# Altium project S3_LCD_GC9503.PrjPcb
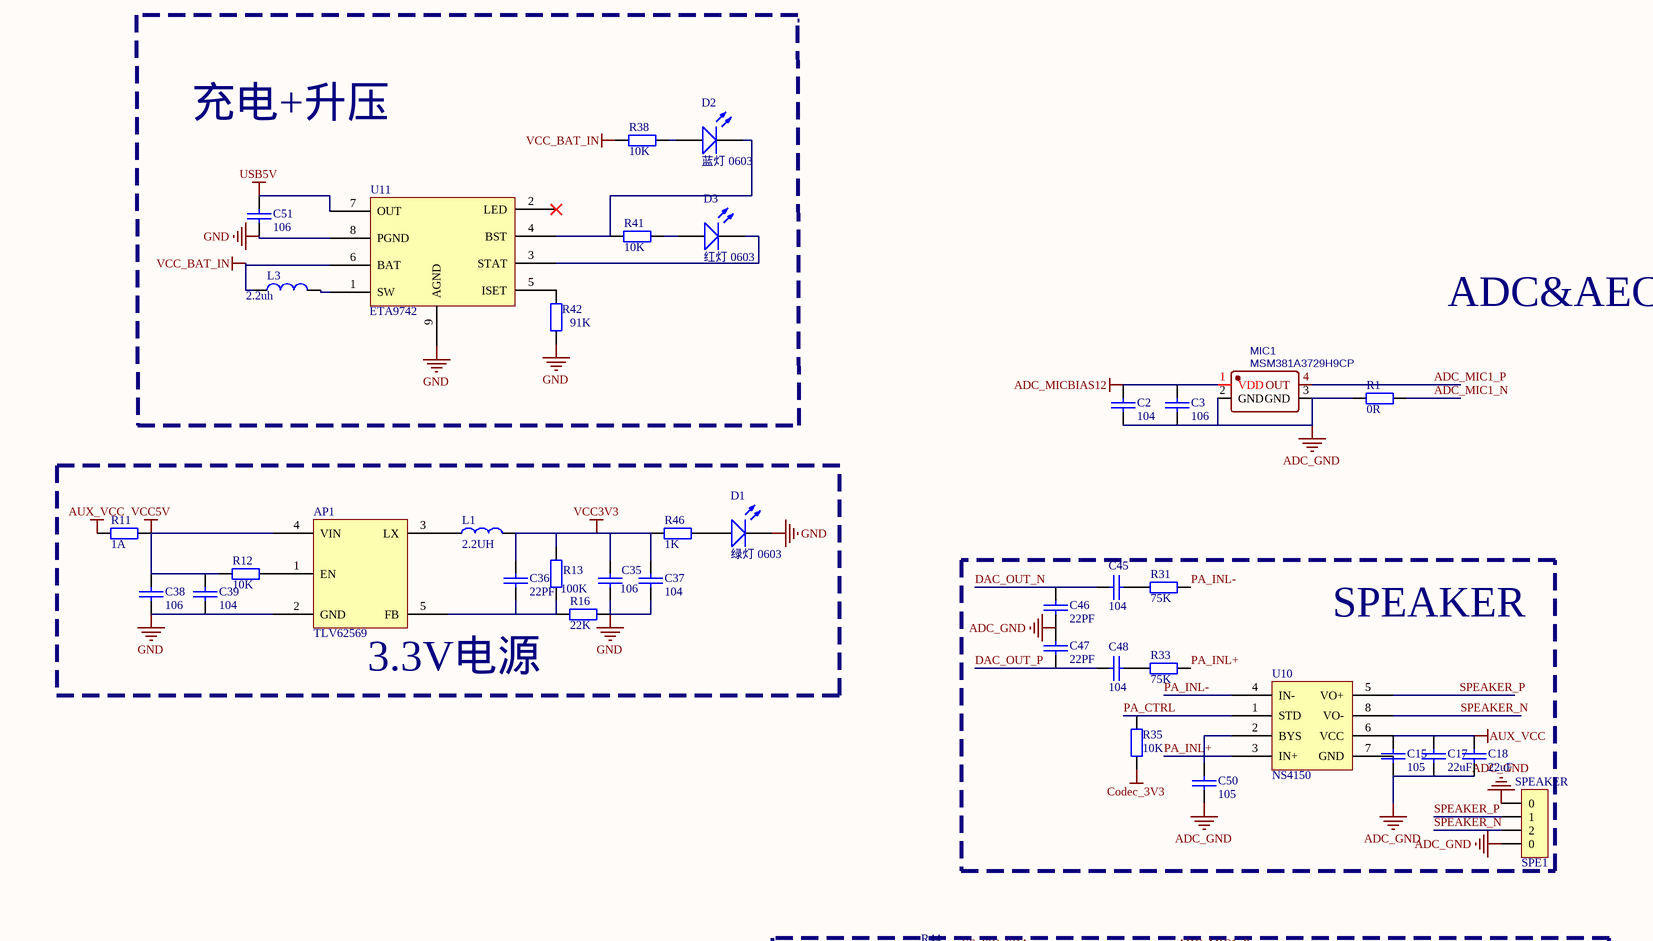
[diagram p0: S3_LCD_GC9503_.SchDoc, top left]
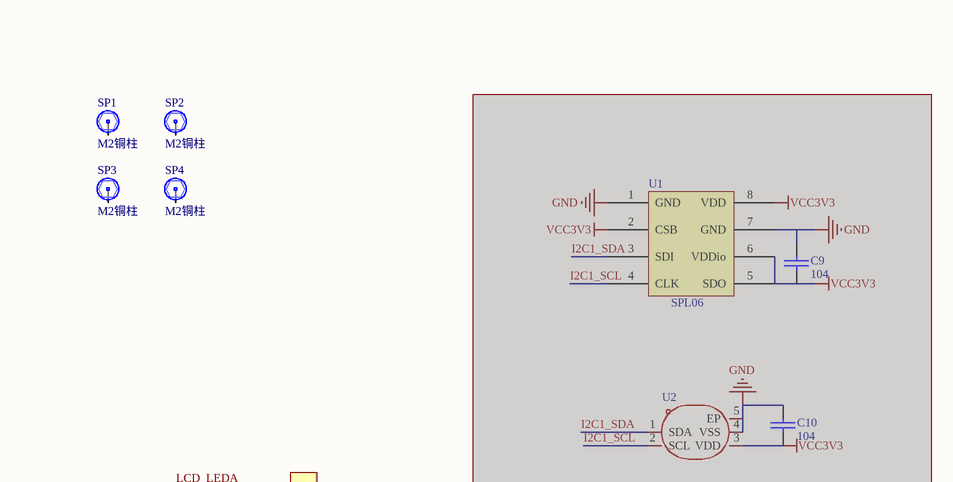
[diagram p1: S3_LCD_GC9503_.SchDoc, top right]
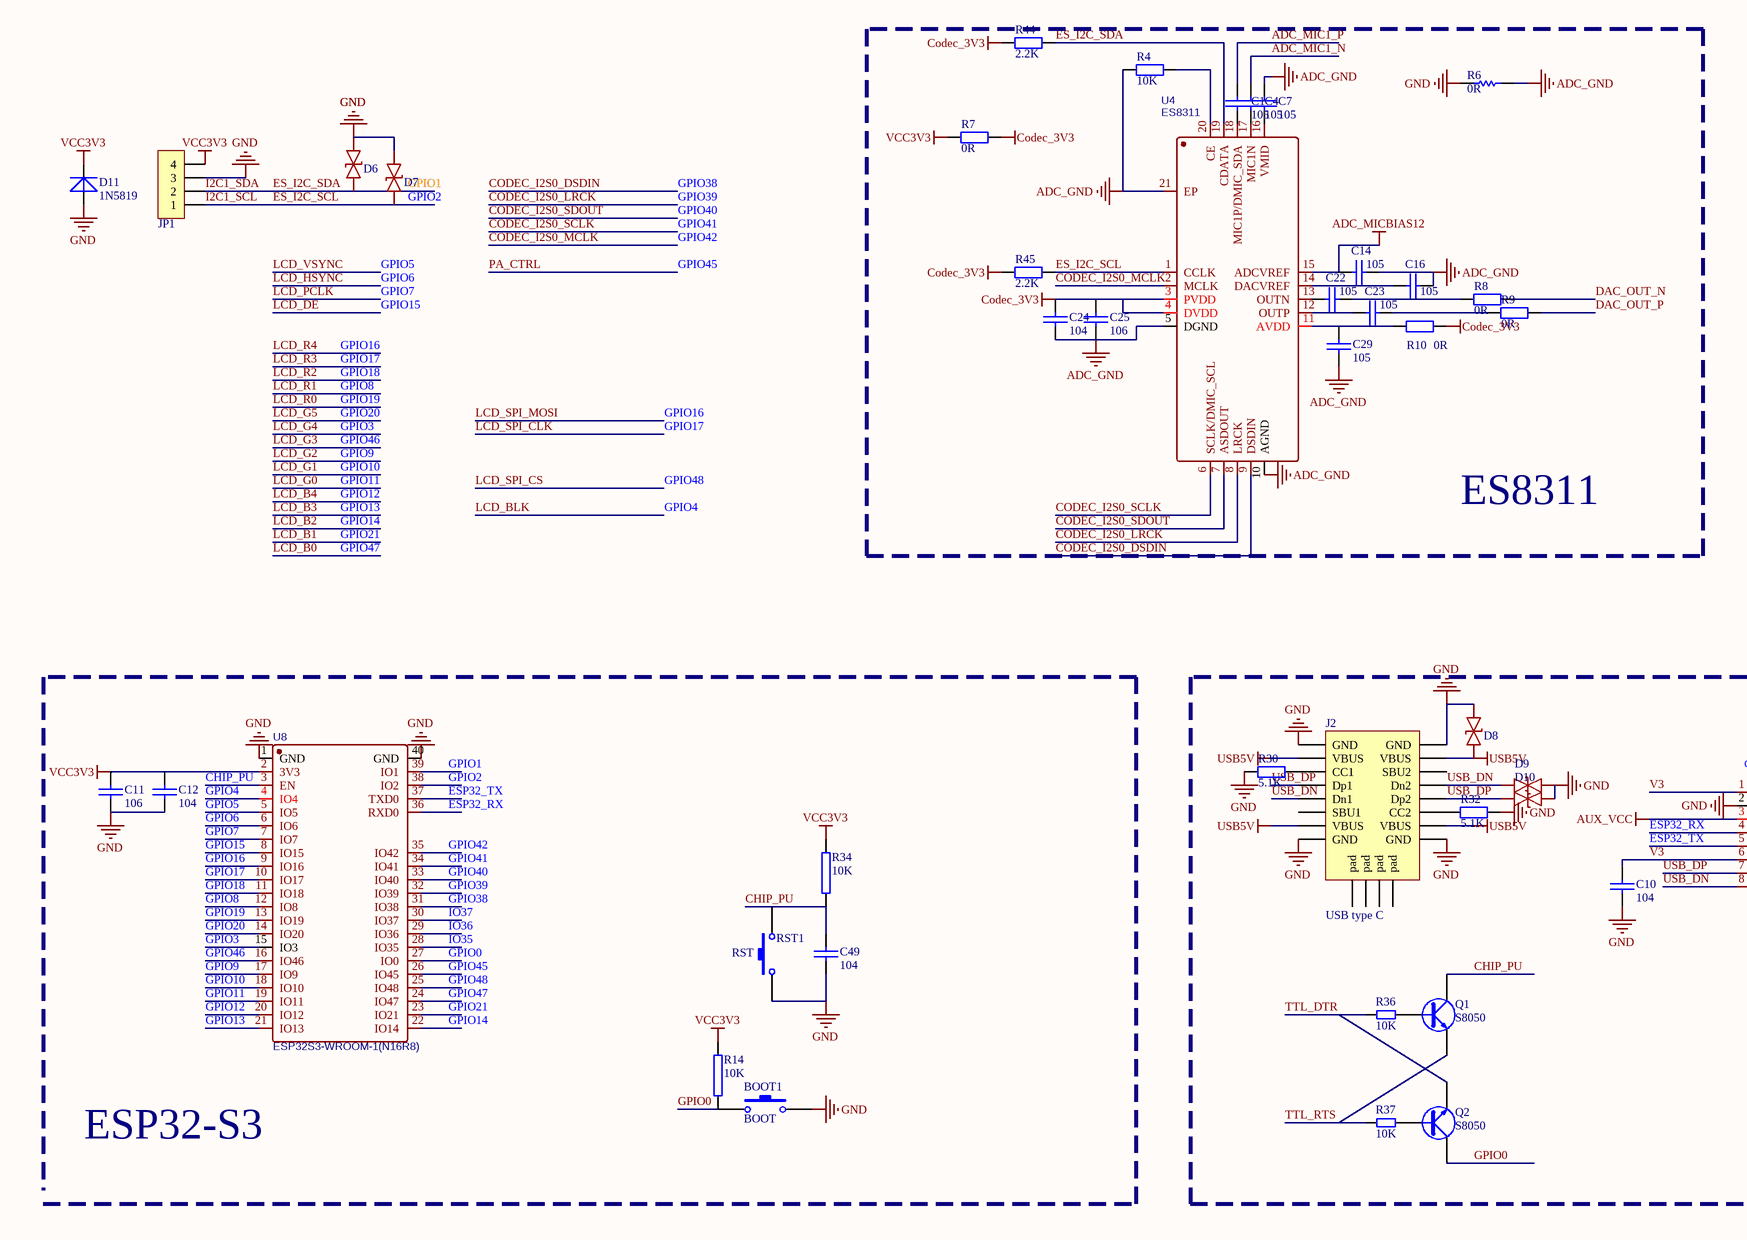
[diagram p2: S3_LCD_GC9503_.SchDoc, bottom left]
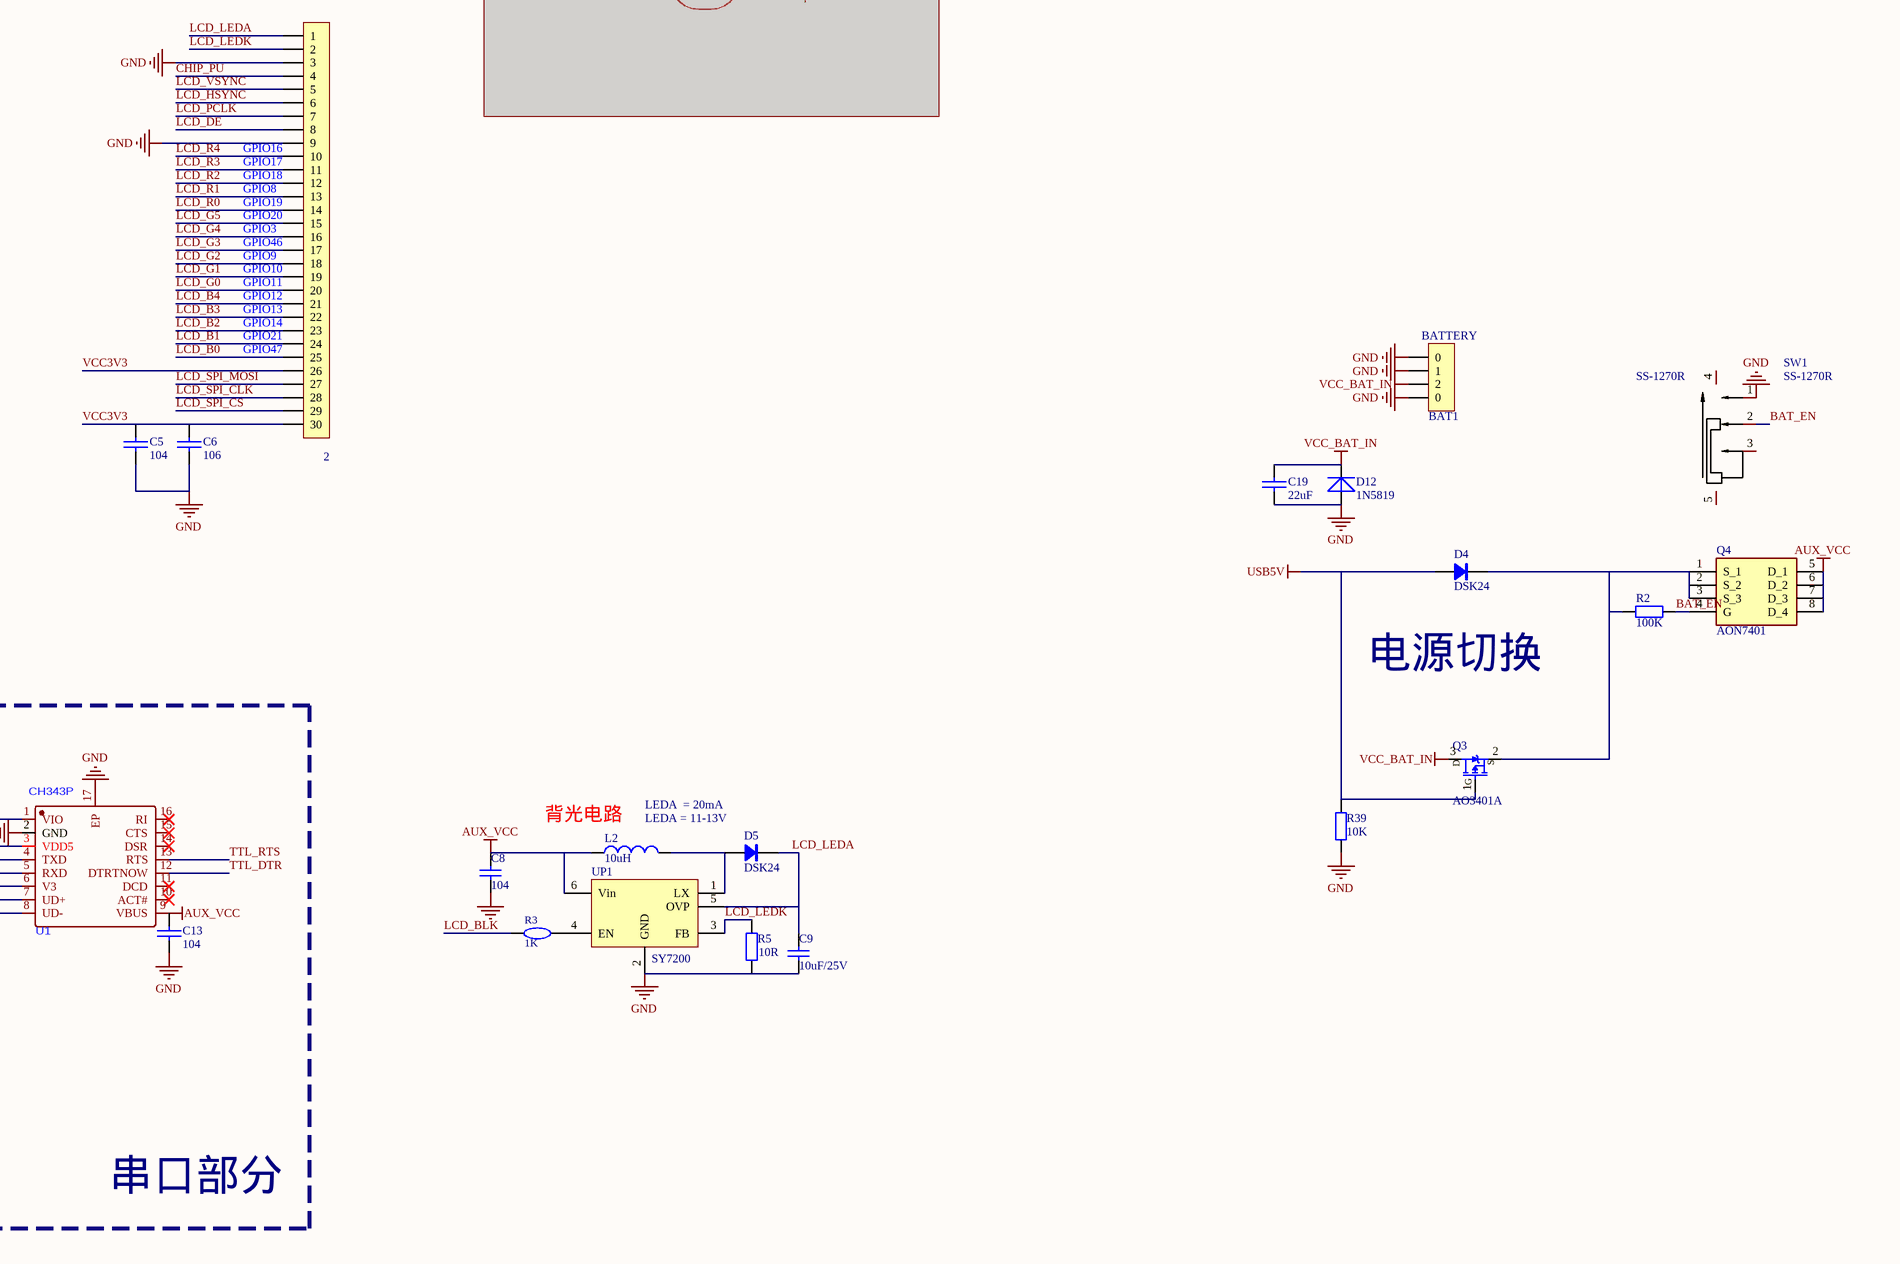
[diagram p3: S3_LCD_GC9503_.SchDoc, bottom right]
1 sheet, 109 parts. Net scope: global (net labels, ports and power ports of the same name join across sheets).
Board file: S3_LCD_GC9503_.PcbDoc

## Sheet S3_LCD_GC9503_.SchDoc
size A1; SheetNumber: 1; SheetTotal: 1

### Parts
(Parts that share a designator on the sheet are numbered #1, #2 ... from top to bottom, then left to right.)
2  FPC0.5-30P  [FPC0.5 2H-WS-30P]  (value not drawn)
AP1  TLV62569  [SOT23-5N]
BAT1  BATTERY  [MOLEX 53398-0271]
BOOT1  BOOT  [TSW 3*6*4.3-S-W]
C1  105  [CAP_0402]
C2  104  [CAP_0402]
C3  106  [C0603]
C4  105  [CAP_0402]
C5  104  [CAP_0402]
C6  106  [CAP_0402]
C7  105  [CAP_0402]
C8  104  [CAP_0402]
C9#1  104  [LC-0402_C]  (masked out: inside a compile mask, not in the netlist)
C9#2  10uF/25V  [C 1206_M]
C10#1  104  [LC-0402_C]  (masked out: inside a compile mask, not in the netlist)
C10#2  104  [CAP_0402]
C11  106  [C0603]
C12  104  [CAP_0402]
C13  104  [CAP_0402]
C14  105  [CAP_0402]
C15  105  [CAP_0402]
C16  105  [CAP_0402]
C17  22uF  [C0603]
C18  22uF  [C0603]
C19  22uF  [C0603]
C22  105  [CAP_0402]
C23  105  [CAP_0402]
C24  104  [CAP_0402]
C25  106  [CAP_0402]
C29  105  [CAP_0402]
C35  106  [C0603]
C36  22PF  [CAP_0402]
C37  104  [CAP_0402]
C38  106  [C0603]
C39  104  [CAP_0402]
C45  104  [CAP_0402]
C46  22PF  [CAP_0402]
C47  22PF  [CAP_0402]
C48  104  [CAP_0402]
C49  104  [CAP_0402]
C50  105  [CAP_0402]
C51  106  [C0603]
D1  绿灯 0603  [0603_LED_S1]
D2  蓝灯 0603  [0603_LED_S1]
D3  红灯 0603  [0603_LED_S1]
D4  DSK24  [SOD-123]
D5  DSK24  [SOD-123]
D6  LESD5D5.0CT1G  [SOD-523]  (value not drawn)
D7  LESD5D5.0CT1G  [SOD-523]  (value not drawn)
D8  LESD5D5.0CT1G  [SOD-523]  (value not drawn)
D9  LESD5D5.0CT1G  [SOD-523]  (value not drawn)
D10  LESD5D5.0CT1G  [SOD-523]  (value not drawn)
D11  1N5819  [SOD-323]
D12  1N5819  [SOD-323]
J2  USB type C  [USB Type-C-16Pin_A]
JP1  HDR-1X4  [MX 1.25-WS-4P]  (value not drawn)
L1  2.2UH  [NR2520]
L2  10uH  [CD42]
L3  2.2uh  [NR2520]
MIC1  MSM381A3729H9CP  [MIC-SMD_4P-L3.8-W3.0-P2.46-S1.70-TR]
Q1  S8050  [SOT23-3N]
Q2  S8050  [SOT23-3N]
Q3  AO3401A  [SOT23-3N]
Q4  AON7401  [DFN_3X3_EP]
R1  0R  [RES_0402]
R2  100K  [RES_0402]
R3  1K  [RES_0402]
R4  10K  [RES_0402]
R5  10R  [R 0805_L]
R6  0R  [R 0603_L]
R7  0R  [RES_0402]
R8  0R  [RES_0402]
R9  0R  [RES_0402]
R10  0R  [RES_0402]
R11  1A  [0805_R]
R12  10K  [RES_0402]
R13  100K  [RES_0402]
R14  10K  [RES_0402]
R16  22K  [RES_0402]
R30  5.1K  [RES_0402]
R31  75K  [RES_0402]
R32  5.1K  [RES_0402]
R33  75K  [RES_0402]
R34  10K  [RES_0402]
R35  10K  [RES_0402]
R36  10K  [RES_0402]
R37  10K  [RES_0402]
R38  10K  [RES_0402]
R39  10K  [RES_0402]
R41  10K  [RES_0402]
R42  91K  [LC-0603_R]
R44  2.2K  [RES_0402]
R45  2.2K  [RES_0402]
R46  1K  [RES_0402]
RST1  RST  [TSW 3*6*4.3-S-W]
SP1  M2铜柱  [M2_1MM_3.5_6.5]
SP2  M2铜柱  [M2_1MM_3.5_6.5]
SP3  M2铜柱  [M2_1MM_3.5_6.5]
SP4  M2铜柱  [M2_1MM_3.5_6.5]
SPE1  SPEAKER  [MOLEX 53398-0271]
SW1  SS-1270R  [SW-TH_MSK01-AG1.5]
U1#1  SPL06  [BMP280]  (masked out: inside a compile mask, not in the netlist)
U1#2  CH343P  [QFN16_3*3_PAD]
U2  SHT40-AD1B with pin  [SENSORM-SMD_SHT40-AD1B]  (value not drawn)  (masked out: inside a compile mask, not in the netlist)
U4  ES8311  [ES8311]
U8  ESP32S3-WROOM-1(N16R8)  [ESP32S3-WROOM-1]
U10  NS4150  [MSOP-8]
U11  ETA9742  [SOIC-8(add 9pin)]
UP1  SY7200  [SOT23-6]

### Blocks framed on the sheet
3.3V电源: AP1 C35-C39 D1 L1 R11-R13 R16 R46
SPEAKER: C15 C17 C18 C45-C48 C50 R31 R33 R35 SPE1 U10
ES8311: C1 C4 C7 C14 C16 C22-C25 C29 R4 R6-R10 R44 R45 U4
串口部分: C10#2 C13 D8-D10 J2 Q1 Q2 R30 R32 R36 R37 U1#2

### Nets
ADC_GND: C2.2 C3.2 C7.2 C14.1 C15.2 C16.2 C17.2 C18.2 C24.2 C25.2 C29.2 C46.2 C47.1 C50.2 MIC1.2(GND) MIC1.3(GND) R1.2 R4.2 R6.2 SPE1.0 U4.5(DGND) U4.10(AGND) U4.21(EP) U10.7(GND)
ADC_MICBIAS12: C2.1 C3.1 C14.2 MIC1.1(VDD) U4.15(ADCVREF)
AUX_VCC: C8.2 C13.2 C15.1 C17.1 C18.1 L2.1 Q4.5(D_1) Q4.6(D_2) Q4.7(D_3) Q4.8(D_4) R11.2 U1#2.3(VDD5) U1#2.9(VBUS) U10.6(VCC) UP1.6(Vin)
Codec_3V3: C24.1 C25.1 R7.1 R10.1 R35.2 R44.2 R45.2 U4.3(PVDD) U4.4(DVDD)
GND: 2.3 2.9 AP1.2(GND) BAT1.0 BAT1.1 BOOT1.2 C5.2 C6.2 C8.1 C9#2.1 C10#2.2 C11.1 C12.1 C13.1 C19.2 C35.1 C37.1 C38.1 C39.1 C49.1 C51.2 D1.K D6.2 D7.2 D8.2 D9.2 D10.2 D11.1 D12.1 J2.A1(GND) J2.A12(GND) J2.B1(GND) J2.B12(GND) JP1.3 R5.2 R6.1 R16.1 R30.1 R32.2 R39.1 R42.2 RST1.1 SW1.1 U1#2.2(GND) U1#2.17(EP) U8.1(GND) U8.40(GND) U11.8(PGND) U11.9(AGND) UP1.2(GND)
USB5V: C51.1 D4.1(A) D8.1 J2.A4(VBUS) J2.A9(VBUS) J2.B4(VBUS) J2.B9(VBUS) Q3.1(G) R39.2 U11.7(OUT)
VCC3V3: 2.26 2.30 C5.1 C6.1 C11.2 C12.2 C35.2 C36.2 C37.2 D11.2 JP1.4 L1.1 R7.2 R13.1 R14.1 R34.1 R46.2 U8.2(3V3)
VCC5V: AP1.4(VIN) C38.2 C39.2 R11.1 R12.2
VCC_BAT_IN: BAT1.2 C19.1 D12.2 L3.1 Q3.3(D) R38.2 U11.6(BAT)
ADC_MIC1_N: C4.2 R1.1
ADC_MIC1_P: C1.2 MIC1.4(OUT)
BAT_EN: Q4.4(G) R2.1 SW1.2
CHIP_PU: 2.4 C49.2 Q1.3(C) R34.2 RST1.2 U8.3(EN)
CODEC_I2S0_DSDIN: U4.9(DSDIN) U8.31(IO38)  [also labelled GPIO38]
CODEC_I2S0_LRCK: U4.8(LRCK) U8.32(IO39)  [also labelled GPIO39]
CODEC_I2S0_MCLK: U4.2(MCLK) U8.35(IO42)  [also labelled GPIO42]
CODEC_I2S0_SCLK: U4.6(SCLK/DMIC_SCL) U8.34(IO41)  [also labelled GPIO41]
CODEC_I2S0_SDOUT: U4.7(ASDOUT) U8.33(IO40)  [also labelled GPIO40]
DAC_OUT_N: C45.2 C46.1 R8.1
DAC_OUT_P: C47.2 C48.2 R9.1
ES_I2C_SCL: D7.1 JP1.1 R45.1 U4.1(CCLK) U8.38(IO2)  [also labelled GPIO2, I2C1_SCL]
ES_I2C_SDA: D6.1 JP1.2 R44.1 U4.19(CDATA) U8.39(IO1)  [also labelled GPIO1, I2C1_SDA]
ESP32_RX: U1#2.4(TXD) U8.36(RXD0)
ESP32_TX: U1#2.5(RXD) U8.37(TXD0)
GPIO0: BOOT1.1 Q2.3(C) R14.2 U8.27(IO0)
GPIO3: 2.16 U8.15(IO3)  [also labelled LCD_G4]
GPIO4: R3.1 U8.4(IO4)  [also labelled LCD_BLK]
GPIO5: 2.5 U8.5(IO5)  [also labelled LCD_VSYNC]
GPIO6: 2.6 U8.6(IO6)  [also labelled LCD_HSYNC]
GPIO7: 2.7 U8.7(IO7)  [also labelled LCD_PCLK]
GPIO8: 2.13 U8.12(IO8)  [also labelled LCD_R1]
GPIO9: 2.18 U8.17(IO9)  [also labelled LCD_G2]
GPIO10: 2.19 U8.18(IO10)  [also labelled LCD_G1]
GPIO11: 2.20 U8.19(IO11)  [also labelled LCD_G0]
GPIO12: 2.21 U8.20(IO12)  [also labelled LCD_B4]
GPIO13: 2.22 U8.21(IO13)  [also labelled LCD_B3]
GPIO14: 2.23 U8.22(IO14)  [also labelled LCD_B2]
GPIO15: 2.8 U8.8(IO15)  [also labelled LCD_DE]
GPIO16: 2.10 2.27 U8.9(IO16)  [also labelled LCD_R4, LCD_SPI_MOSI]
GPIO17: 2.11 2.28 U8.10(IO17)  [also labelled LCD_R3, LCD_SPI_CLK]
GPIO18: 2.12 U8.11(IO18)  [also labelled LCD_R2]
GPIO19: 2.14 U8.13(IO19)  [also labelled LCD_R0]
GPIO20: 2.15 U8.14(IO20)  [also labelled LCD_G5]
GPIO21: 2.24 U8.23(IO21)  [also labelled LCD_B1]
GPIO45: R35.1 U8.26(IO45) U10.1(STD)  [also labelled PA_CTRL]
GPIO46: 2.17 U8.16(IO46)  [also labelled LCD_G3]
GPIO47: 2.25 U8.24(IO47)  [also labelled LCD_B0]
GPIO48: 2.29 U8.25(IO48)  [also labelled LCD_SPI_CS]
IO35: U8.28(IO35)
IO36: U8.29(IO36)
IO37: U8.30(IO37)
LCD_LEDA: 2.1 C9#2.2 D5.2(K) UP1.5(OVP)
LCD_LEDK: 2.2 R5.1 UP1.3(FB)
PA_INL+: R33.2 U10.3(IN+)
PA_INL-: R31.2 U10.4(IN-)
SPEAKER_N: SPE1.2 U10.8(VO-)
SPEAKER_P: SPE1.1 U10.5(VO+)
TTL_DTR: Q2.2(E) R36.1 U1#2.12(DTRTNOW)
TTL_RTS: Q1.2(E) R37.1 U1#2.13(RTS)
USB_DN: D9.1 J2.A7(Dn1) J2.B7(Dn2) U1#2.8(UD-)
USB_DP: D10.1 J2.A6(Dp1) J2.B6(Dp2) U1#2.7(UD+)
V3: C10#2.1 U1#2.1(VIO) U1#2.6(V3)
NetAP1_1: AP1.1(EN) R12.1
NetAP1_3: AP1.3(LX) L1.2
NetAP1_5: AP1.5(FB) C36.1 R13.2 R16.2
NetC1_1: C1.1 U4.18(MIC1P/DMIC_SDA)
NetC4_1: C4.1 U4.17(MIC1N)
NetC7_1: C7.1 U4.16(VMID)
NetC16_1: C16.1 U4.14(DACVREF)
NetC22_1: C22.1 R8.2
NetC22_2: C22.2 U4.13(OUTN)
NetC23_1: C23.1 R9.2
NetC23_2: C23.2 U4.12(OUTP)
NetC29_1: C29.1 R10.2 U4.11(AVDD)
NetC45_1: C45.1 R31.1
NetC48_1: C48.1 R33.1
NetC50_1: C50.1 U10.2(BYS)
NetD1_A: D1.A R46.1
NetD2_A: D2.A R38.1
NetD2_K: D2.K R41.2 U11.4(BST)
NetD3_A: D3.A R41.1
NetD3_K: D3.K U11.3(STAT)
NetD4_2: D4.2(K) Q3.2(S) Q4.1(S_1) Q4.2(S_2) Q4.3(S_3) R2.2
NetD5_1: D5.1(A) L2.2 UP1.1(LX)
NetJ2_A5: J2.A5(CC1) R30.2
NetJ2_B5: J2.B5(CC2) R32.1
NetL3_2: L3.2 U11.1(SW)
NetQ1_1: Q1.1(B) R36.2
NetQ2_1: Q2.1(B) R37.2
NetR3_2: R3.2 UP1.4(EN)
NetR4_1: R4.1 U4.20(CE)
NetR42_1: R42.1 U11.5(ISET)

Not connected (* = marked no-connect by the designer): J2 0(pad) A8(SBU1) B8(SBU2); SP1 1; SP2 1; SP3 1; SP4 1; SW1 3 4 5; U1#2 10(ACT#)* 11(DCD)* 14(DSR)* 15(CTS)* 16(RI)*; U11 2(LED)*

### Notes on the sheet
- 充电+升压
- ADC&AEC
- 电源切换
- (near L2) 背光电路
- LEDA  = 20mA
- LEDA = 11-13V
- ESP32-S3

### Library data of the parts
2 = FPC-30P: FPC连接器; 版权归属: 源创客; BOM名称: FPC连接器; 学习资源: www.ooocke.com
AP1 = AP3410
BAT1 SPE1 = Header 4: MX1.25mm 立贴; BOM名称: 4P接插件; 版权归属: 源创客; 学习资源: www.ooocke.com
BOOT1 RST1 = SW-PB: Switch; Published: 24-Mar-1999; LatestRevisionDate: 17-Jul-2002; LatestRevisionNote: Re-released for DXP Platform.; PackageReference: SPST-2; Publisher: Altium Limited; PackageDescription: Switch; 2 Leads
C1-C7 C9#1 C10#1 C10#2 C13-C19 C22-C25 C29 C45-C51 = CAP
C8 C9#2 = MCD-00211: 10V; Manufacturer_Part_Number: CC0603KRX7R7BB104; Manufacturer: YAGEO; Provided_By: Subcon; Initial_Board_Reference: mb1319; Internal_Part_Number: MCD-00211; Status: Released; Part_Type: Capacitor; Package: C0603; ComponentLink1Description: Yageo_Capacitor_X7R-series.pdf; ComponentLink1URL: http://tunmcdsvn.tun.st.com/Component_Datasheet_Library/Trunk/Capacitors/Yageo_Capacitor_X7R-series.pdf; ECCN_US: n/a; ECCN_EU: n/a
C11 C12 C35-C39 = cap
D1-D3 = 0603 白灯: 发光二极管; ComponentLink1Description: 供应商链接; ComponentLink1URL: http://www.szlcsc.com/product/details_2663.html; Package: 0603; Supplier: LC; SuppliersPartNumber: C2290
D4 D5 = SS34: 肖特基二极管; 版权归属: 源创客; 属性: 40V/3A; BOM名称: 肖特基二极管; 学习资源: www.ooocke.com
D6-D10 = LESD5D5.0CT1G: 极性:双向;反向截止电压(Vrwm):5V;最大钳位电压:18.6V;峰值脉冲电流(Ipp)@10/1000us:9.4A;击穿电压:5.6V;; Manufacturer: LRC(乐山无线电); Add into BOM: yes; polarity: 双向; Reverse Stand-Off Voltage (Vrwm): 5V; Maximum Clamping Voltage: 18.6V; Peak Pulse Current (Ipp)@10/1000us: 9.4A; Breakdown Voltage: 5.6V; Type: ESD; Symbol: LESD5D5.0CT1G; Device: LESD5D5.0CT1G; Supplier: LCSC; Supplier Part: C383211; Manufacturer Part: LESD5D5.0CT1G; JLCPCB Part Class: 扩展库; LCSC Part Name: 双向ESD; Supplier Footprint: SOD-523; Datasheet: https://atta.szlcsc.com/upload/public/pdf/source/20190807/C383211_633DF4B4E2C161403226E5235FE33A1C.pdf; Convert to PCB: yes
D11 D12 = 1N4007: 二极管
J2 = USB_C
JP1 = Header 4: 4P接插件; 版权归属: 源创客; BOM名称: 4P接插件; 学习资源: www.ooocke.com
L1 = L1: 电感
L2 = Inductor: 10uH, 4x4x3mm; Code_IEC: 1005; Published: 8-Jun-2000; LatestRevisionDate: 29-May-2009; LatestRevisionNote: IPC-7351 Footprint Added.; PackageReference: 0402-A; Publisher: Altium Limited; PackageDescription: Chip Inductor; Code_JEITA: 0402; Value: 10uH
L3 = L: 贴片功率电感 CD32
MIC1 = MSM381A3729H9CP: BOM_Manufacturer: MEMS(敏芯微); Contributor: LCSC; BOM_Supplier: LCSC; BOM_Supplier Part: C966940; BOM_Manufacturer Part: MSM381A3729H9CP; BOM_JLCPCB Part Class: Extended Part; spicePre: M; spiceSymbolName: MSM381A3729H9CP
Q1 Q2 = Q S9013
Q3 = AO3401: P沟道 30V/4.2A; BOM名称: 场效应管; 版权归属: 源创客; 学习资源: www.ooocke.com; 描述: P沟道 30V/4.2A
Q4 = AON7401: MOSFET (P-Channel); Manufacturer_Name: Alpha & Omega Semiconductors; Datasheet Link: http://aosmd.com/res/data_sheets/AON7401.pdf; Manufacturer_Part_Number: AON7401; Arrow Part Number: AON7401; Arrow Price/Stock: https://www.arrow.com/en/products/aon7401/alpha-and-omega-semiconductor
R1 R2 R4 R7-R13 R16 R30-R33 R35 R38 R39 R41 R42 R44-R46 = RES: 普通电阻
R3 = 10K: Published: 8-Jun-2000; LatestRevisionDate: 17-Jul-2002; LatestRevisionNote: Re-released for DXP Platform.; PackageReference: AXIAL-0.4; Publisher: Altium Limited; Comment_1: 1K
R5 = R_1M_R0603_5%: R1210
R6 = Res1: 贴片电阻; Value: 10K; Published: 8-Jun-2000; LatestRevisionDate: 17-Jul-2002; LatestRevisionNote: Re-released for DXP Platform.; PackageReference: AXIAL-0.3; Publisher: Altium Limited; PackageDescription: Axial Device, Thru-Hole; 2 Leads; 0.3 in Pin Spacing
R14 R34 = RES
R36 R37 = R_0Ω_0603
SP1-SP4 = 铜柱小焊盘: 铜柱; 版权归属: 源创客; BOM名称: 铜柱; 学习资源: www.ooocke.com
SW1 = SS-1270R: Manufacturer: RISHENG(日昇); Add into BOM: yes; Name: SS-1270R; Symbol: SS-1270R; Device: SS-1270R; LCSC Part Name: 拨动开关; Supplier Part: C589299; Manufacturer Part: SS-1270R; Supplier Footprint: SMD; JLCPCB Part Class: Extended Part; Datasheet: https://atta.szlcsc.com/upload/public/pdf/source/20200922/C589299_3BAB7E93890FCDC37968137D0F36FD65.pdf; Supplier: LCSC; Convert to PCB: yes
U1#1 = BMP280
U2 = SHT40-AD1B with pin: 电赛专用产品; Manufacturer: Sensirion(瑞士盛思锐); Add into BOM: yes; Symbol: SHT40-AD1B WITH PIN; Device: SHT40-AD1B with pin; LCSC Part Name: SHT40-AD1B with pin 停产; Supplier Part: C22437501; Manufacturer Part: SHT40-AD1B with pin; Supplier Footprint: SMD,1.5x1.5mm; JLCPCB Part Class: 扩展库; Datasheet: https://atta.szlcsc.com/upload/public/pdf/source/20240722/3BD094C483E6DD673F5061D49CA37888.pdf; Supplier: LCSC; Convert to PCB: yes
U4 = ES8311-S: BOM_Manufacturer: null; Contributor: lcsc; BOM_Supplier: LCSC; BOM_Supplier Part: C9900015232; BOM_Manufacturer Part: ES8311-S; BOM_JLCPCB Part Class: Extended Part; spicePre: U; spiceSymbolName: ES8311-S
U8 = ESP32S3-WROOM-1: BOM_Manufacturer: Espressif Systems; BOM_Manufacturer Part: ESP32-WROOM-32E(8MB); Contributor: LCSC; BOM_Supplier: LCSC; BOM_Supplier Part: C701342; BOM_JLCPCB Part Class: Extended Part; spicePre: U; spiceSymbolName: ESP32-WROOM-32E(8MB)
U10 = LM4871